# EAGLE design convert_module (EAGLE 8.0.1)

## Sheet 1 of 3
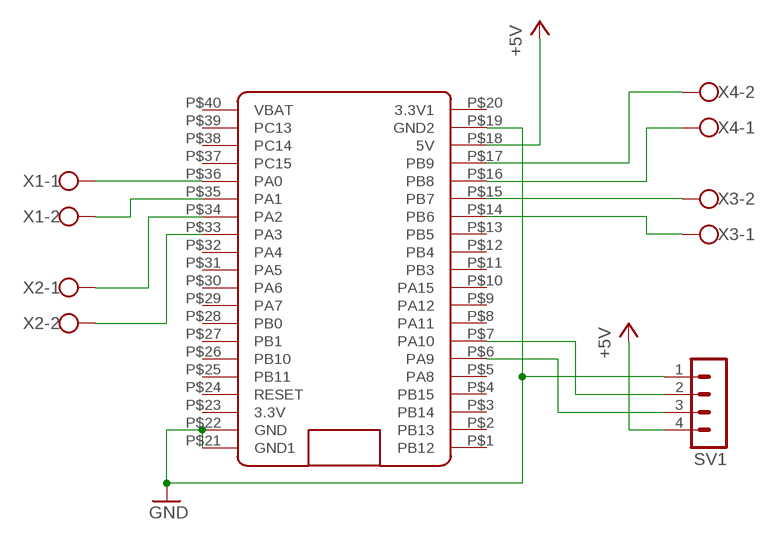
[diagram p0: schematic, sheet 1]

### Parts
SV1  MA04-1  [MA04-1]
U$1  BLUE_PILL  [BLUE_PILL]
X1  W237-102  [W237-102]
X2  W237-102  [W237-102]
X3  W237-102  [W237-102]
X4  W237-102  [W237-102]

### Nets
+5V: SV1.4 U$1.P$18(5V) ; also sheet 2
GND: SV1.1 U$1.P$19(GND2) U$1.P$21(GND1) U$1.P$22(GND) ; also sheet 2,3
N$1: U$1.P$17(PB9) X4.2
N$2: U$1.P$16(PB8) X4.1
N$3: U$1.P$15(PB7) X3.2
N$4: U$1.P$14(PB6) X3.1
N$5: SV1.2 U$1.P$7(PA10)
N$6: U$1.P$36(PA0) X1.1
N$7: U$1.P$35(PA1) X1.2
N$8: U$1.P$34(PA2) X2.1
N$9: U$1.P$33(PA3) X2.2
N$10: SV1.3 U$1.P$6(PA9)
Unconnected: U$1.P$1(PB12) U$1.P$2(PB13) U$1.P$3(PB14) U$1.P$4(PB15) U$1.P$5(PA8) U$1.P$8(PA11) U$1.P$9(PA12) U$1.P$10(PA15) U$1.P$11(PB3) U$1.P$12(PB4) U$1.P$13(PB5) U$1.P$20(3.3V1) U$1.P$23(3.3V) U$1.P$24(RESET) U$1.P$25(PB11) U$1.P$26(PB10) U$1.P$27(PB1) U$1.P$28(PB0) U$1.P$29(PA7) U$1.P$30(PA6) U$1.P$31(PA5) U$1.P$32(PA4) U$1.P$37(PC15) U$1.P$38(PC14) U$1.P$39(PC13) U$1.P$40(VBAT)

## Sheet 2 of 3
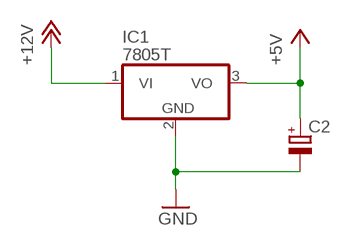
[diagram p1: schematic, sheet 2]

### Parts
C2  CPOL-EUE2.5-5  [E2,5-5]
IC1  7805T  [TO220H]

### Nets
+5V: C2.+ IC1.3(VO) ; also sheet 1
+12V: IC1.1(VI) ; also sheet 3
GND: C2.- IC1.2(GND) ; also sheet 1,3

## Sheet 3 of 3
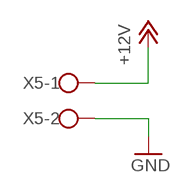
[diagram p2: schematic, sheet 3]

### Parts
X5  W237-102  [W237-102]

### Nets
+12V: X5.1 ; also sheet 2
GND: X5.2 ; also sheet 1,2

## Library data of the parts
C2 = resistor:CPOL-EU: POLARIZED CAPACITOR, European symbol
IC1 = linear:78*: Positive VOLTAGE REGULATOR Source: http://cache.national.com/ds/LM/LM78L05.pdf http://www.fairchildsemi.com/ds/LM/LM7805.pdf
SV1 = con-lstb:MA04-1: PIN HEADER; OC_FARNELL: unknown; OC_NEWARK: unknown
U$1 = BluePill:BLUE_PILL
X1-X5 = con-wago-500:W237-102: WAGO SCREW CLAMP; MPN: 237-102; OC_FARNELL: unknown; OC_NEWARK: 70K9898

## Board
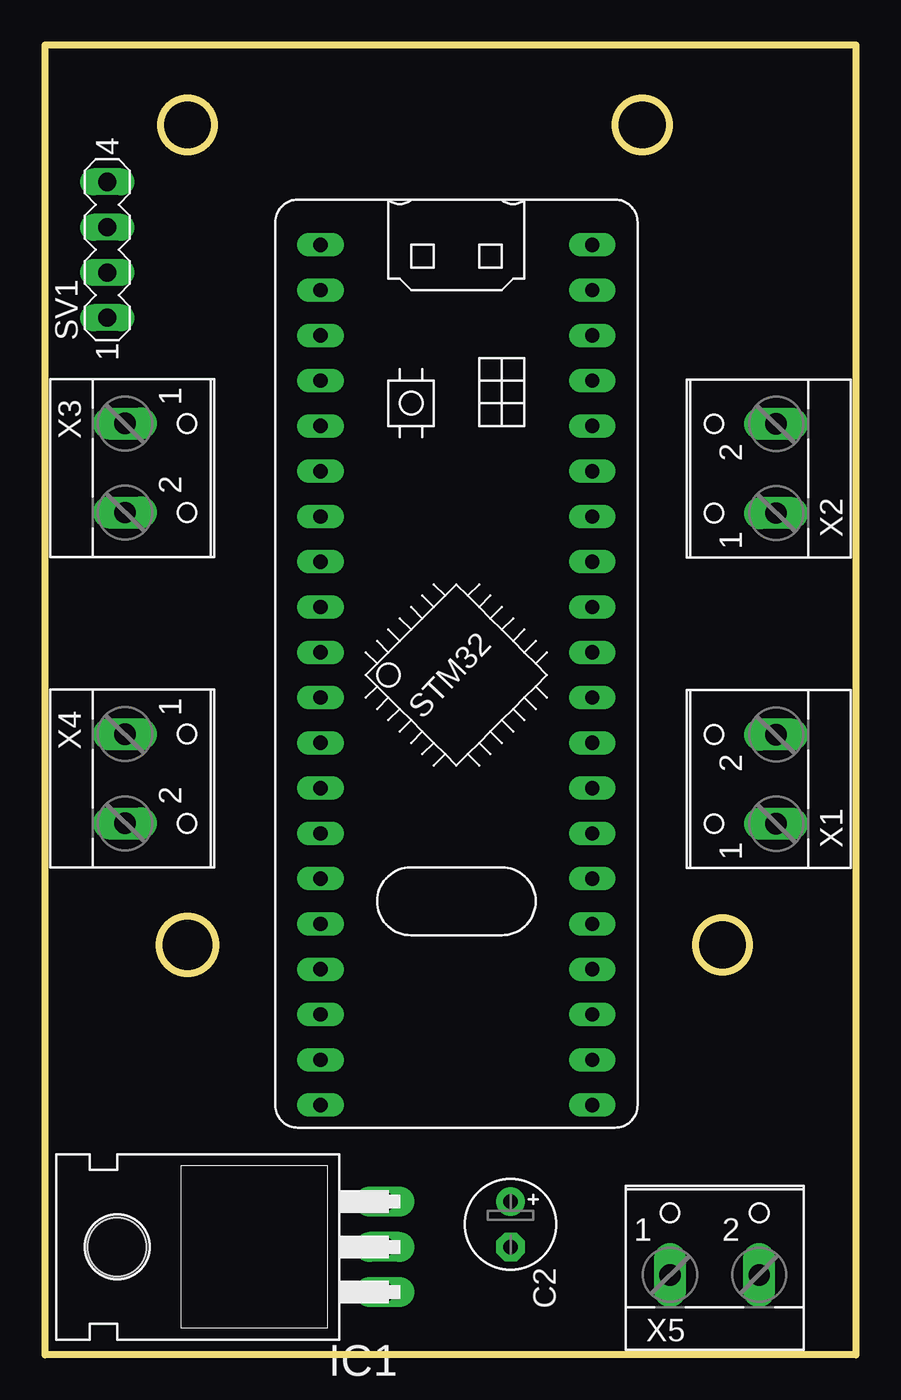
[diagram p3: board, top side]
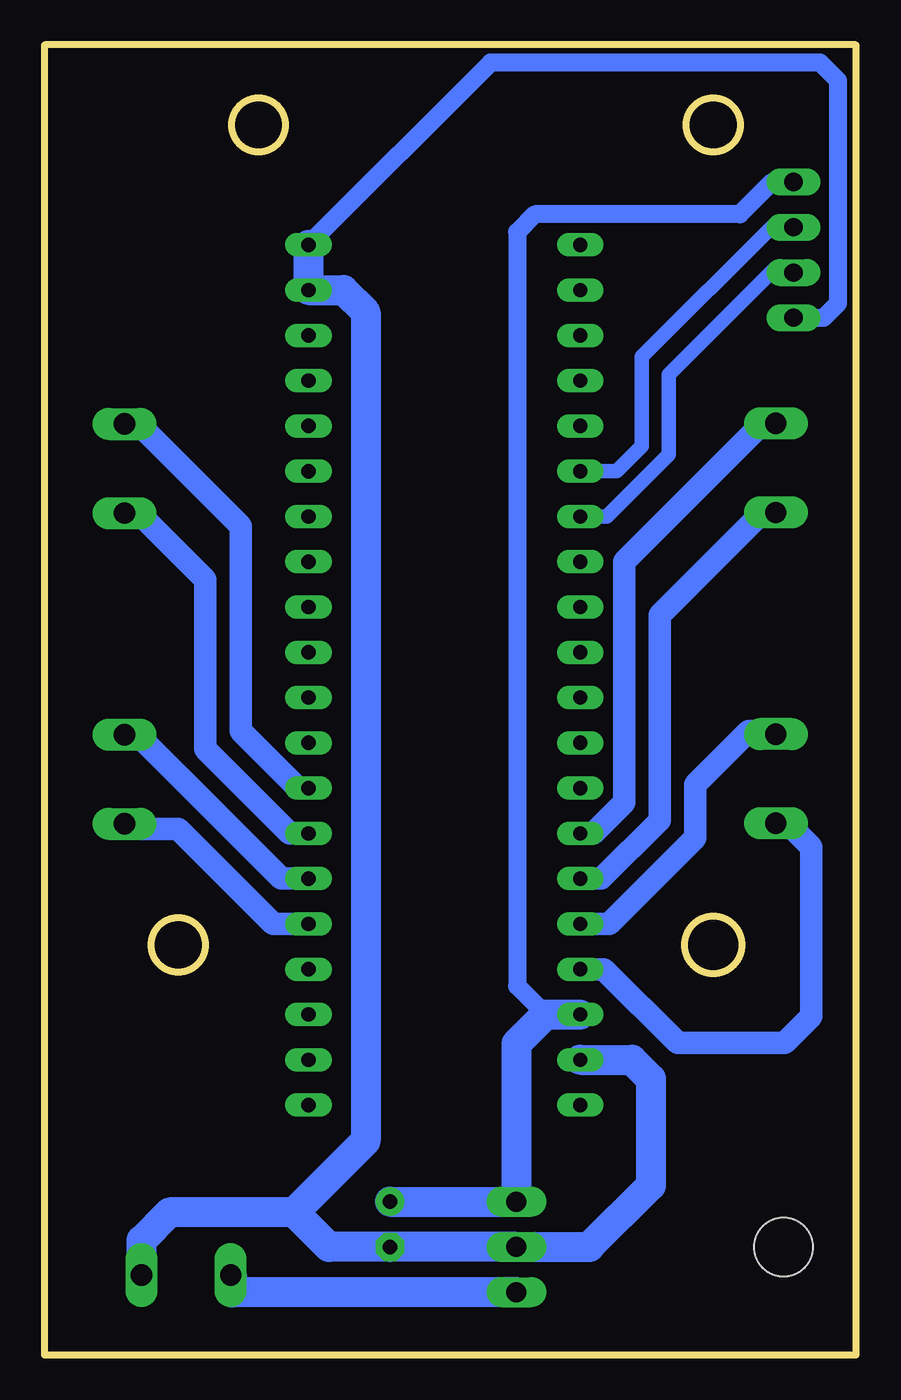
[diagram p4: board, bottom side, seen from below]

Size 45.5 x 73.5 mm. Coordinates in mm from the lower left corner, seen from the top.
Outline: 45.5,0 45.5,73.5 0,73.5 0,0 45.5,0
Outline: circle at 8,69 radius 1.5
Outline: circle at 33.5,69 radius 1.5
Outline: circle at 38,23 radius 1.5
Outline: circle at 8,23 radius 1.58
Copper layers (1*16): Top 0.035mm / dielectric 1.5mm / Bottom 0.035mm
Design rules "default": minimum track width 10mil, minimum drill 24mil, track to track 8mil, track to pad 8mil, pad to pad 8mil, via to via 8mil, smd to smd 8mil, copper to edge 40mil, drill to drill 8mil, minimum pad ring 10mil, minimum via ring 8mil, stop-mask expansion 4mil, vias tented up to drill 0mil, thermal gap 10mil

### Footprints (pad centres in the part's own frame; a part is rotated, then mirrored left to right if it is on the bottom)
E2,5-5 = drill 0.813 pad 1.6: + -1.27,0 | drill 0.813 pad 1.6 octagon: - 1.27,0
TO220H = drill 1.118 long: 1 -2.54,-10.16; 2 0,-10.16; 3 2.54,-10.16 | hole 3.302: 0,4.826
MA04-1 = drill 1.016 long: 1 -3.81,0; 2 -1.27,0; 3 1.27,0; 4 3.81,0
BLUE_PILL = drill 0.8 long: P$1 -7.62,15.24; P$2 -7.62,12.7; P$3 -7.62,10.16; P$4 -7.62,7.62; P$5 -7.62,5.08; P$6 -7.62,2.54; P$7 -7.62,0; P$8 -7.62,-2.54; P$9 -7.62,-5.08; P$10 -7.62,-7.62; P$11 -7.62,-10.16; P$12 -7.62,-12.7; P$13 -7.62,-15.24; P$14 -7.62,-17.78; P$15 -7.62,-20.32; P$16 -7.62,-22.86; P$17 -7.62,-25.4; P$18 -7.62,-27.94; P$19 -7.62,-30.48; P$20 -7.62,-33.02; P$21 7.62,15.24; P$22 7.62,12.7; P$23 7.62,10.16; P$24 7.62,7.62; P$25 7.62,5.08; P$26 7.62,2.54; P$27 7.62,0; P$28 7.62,-2.54; P$29 7.62,-5.08; P$30 7.62,-7.62; P$31 7.62,-10.16; P$32 7.62,-12.7; P$33 7.62,-15.24; P$34 7.62,-17.78; P$35 7.62,-20.32; P$36 7.62,-22.86; P$37 7.62,-25.4; P$38 7.62,-27.94; P$39 7.62,-30.48; P$40 7.62,-33.02
W237-102 = drill 1.194 long: 1 -2.5,-1.27; 2 2.5,-1.27

### Placement (x,y rotation side)
C2  26.12,7.33 270 top
IC1  8.88,6.06 90 top
SV1  3.5,62 90 top
U$1  23.08,47.04 0 top
X1  39.74,32.3 90 top
X2  39.74,49.73 90 top
X3  5.76,49.76 270 top
X4  5.76,32.33 270 top
X5  37.56,5.76 0 top

### Tracks (layer width: path | path; a pad name or v marks a point on that pad's centre or on a via)
+5V
  Bottom 1.016: SV1.4 4.69,65.81 6.5,64 18,64 19,63 19,20.7 17.4,19.1
  Bottom 1.676: C2.+ IC1.3 19.04,17.46 17.4,19.1 U$1.P$18
+12V
  Bottom 1.676: IC1.1 34.98,3.52 35,3.5 35,4.43 X5.1
GND
  Bottom 1.016: SV1.1 1.81,58.19 1,59 1,71.5 2,72.5 20.48,72.5 U$1.P$21
  Bottom 1.676: U$1.P$19 12.56,16.56 11.5,15.5 11.5,9.5 14.94,6.06 IC1.2 C2.- 29.56,6.06 31.5,8 | X5.2 40.06,6.44 38.5,8 31.5,8 | U$1.P$21 U$1.P$22 28.74,59.74 27.5,58.5 27.5,12 31.5,8
N$1
  Bottom 1.27: U$1.P$17 14.14,21.64 10,17.5 4,17.5 2.5,19 2.5,28.5 3.83,29.83 X4.2
N$2
  Bottom 1.27: U$1.P$16 13.82,24.18 9,29 9,32 6,35 4.66,35 X4.1
N$3
  Bottom 1.27: U$1.P$15 14.28,26.72 11,30 11,41.5 5.5,47 4.75,47 X3.2
N$4
  Bottom 1.27: U$1.P$14 14.74,29.26 13,31 13,44.5 5.5,52 4.75,52 X3.1
N$5
  Bottom 0.813: U$1.P$7 13.96,47.04 10.5,50.5 10.5,55 4.5,61 3.27,61 SV1.2
N$6
  Bottom 1.27: U$1.P$36 32.68,24.18 38,29.5 40.71,29.5 X1.1
N$7
  Bottom 1.27: U$1.P$35 32.22,26.72 40.5,35 40.81,35 X1.2
N$8
  Bottom 1.27: U$1.P$34 31.76,29.26 36.5,34 36.5,43.5 40,47 40.78,47 X2.1
N$9
  Bottom 1.27: U$1.P$33 31.3,31.8 34.5,35 34.5,46.5 40,52 40.78,52 X2.2
N$10
  Bottom 0.813: U$1.P$6 13.42,49.58 12,51 12,56 4.5,63.5 3.23,63.5 SV1.3